# EasyEDA schematic SCH_SlimeVR Charge HUB_2022-04-14.json
TITLE: SlimeVR Charge Hub; REV: 1.0; Date: 2022-01-13; Sheet: 1/1; Drawn By: sevenxiaoyu1992; Company: Your Company
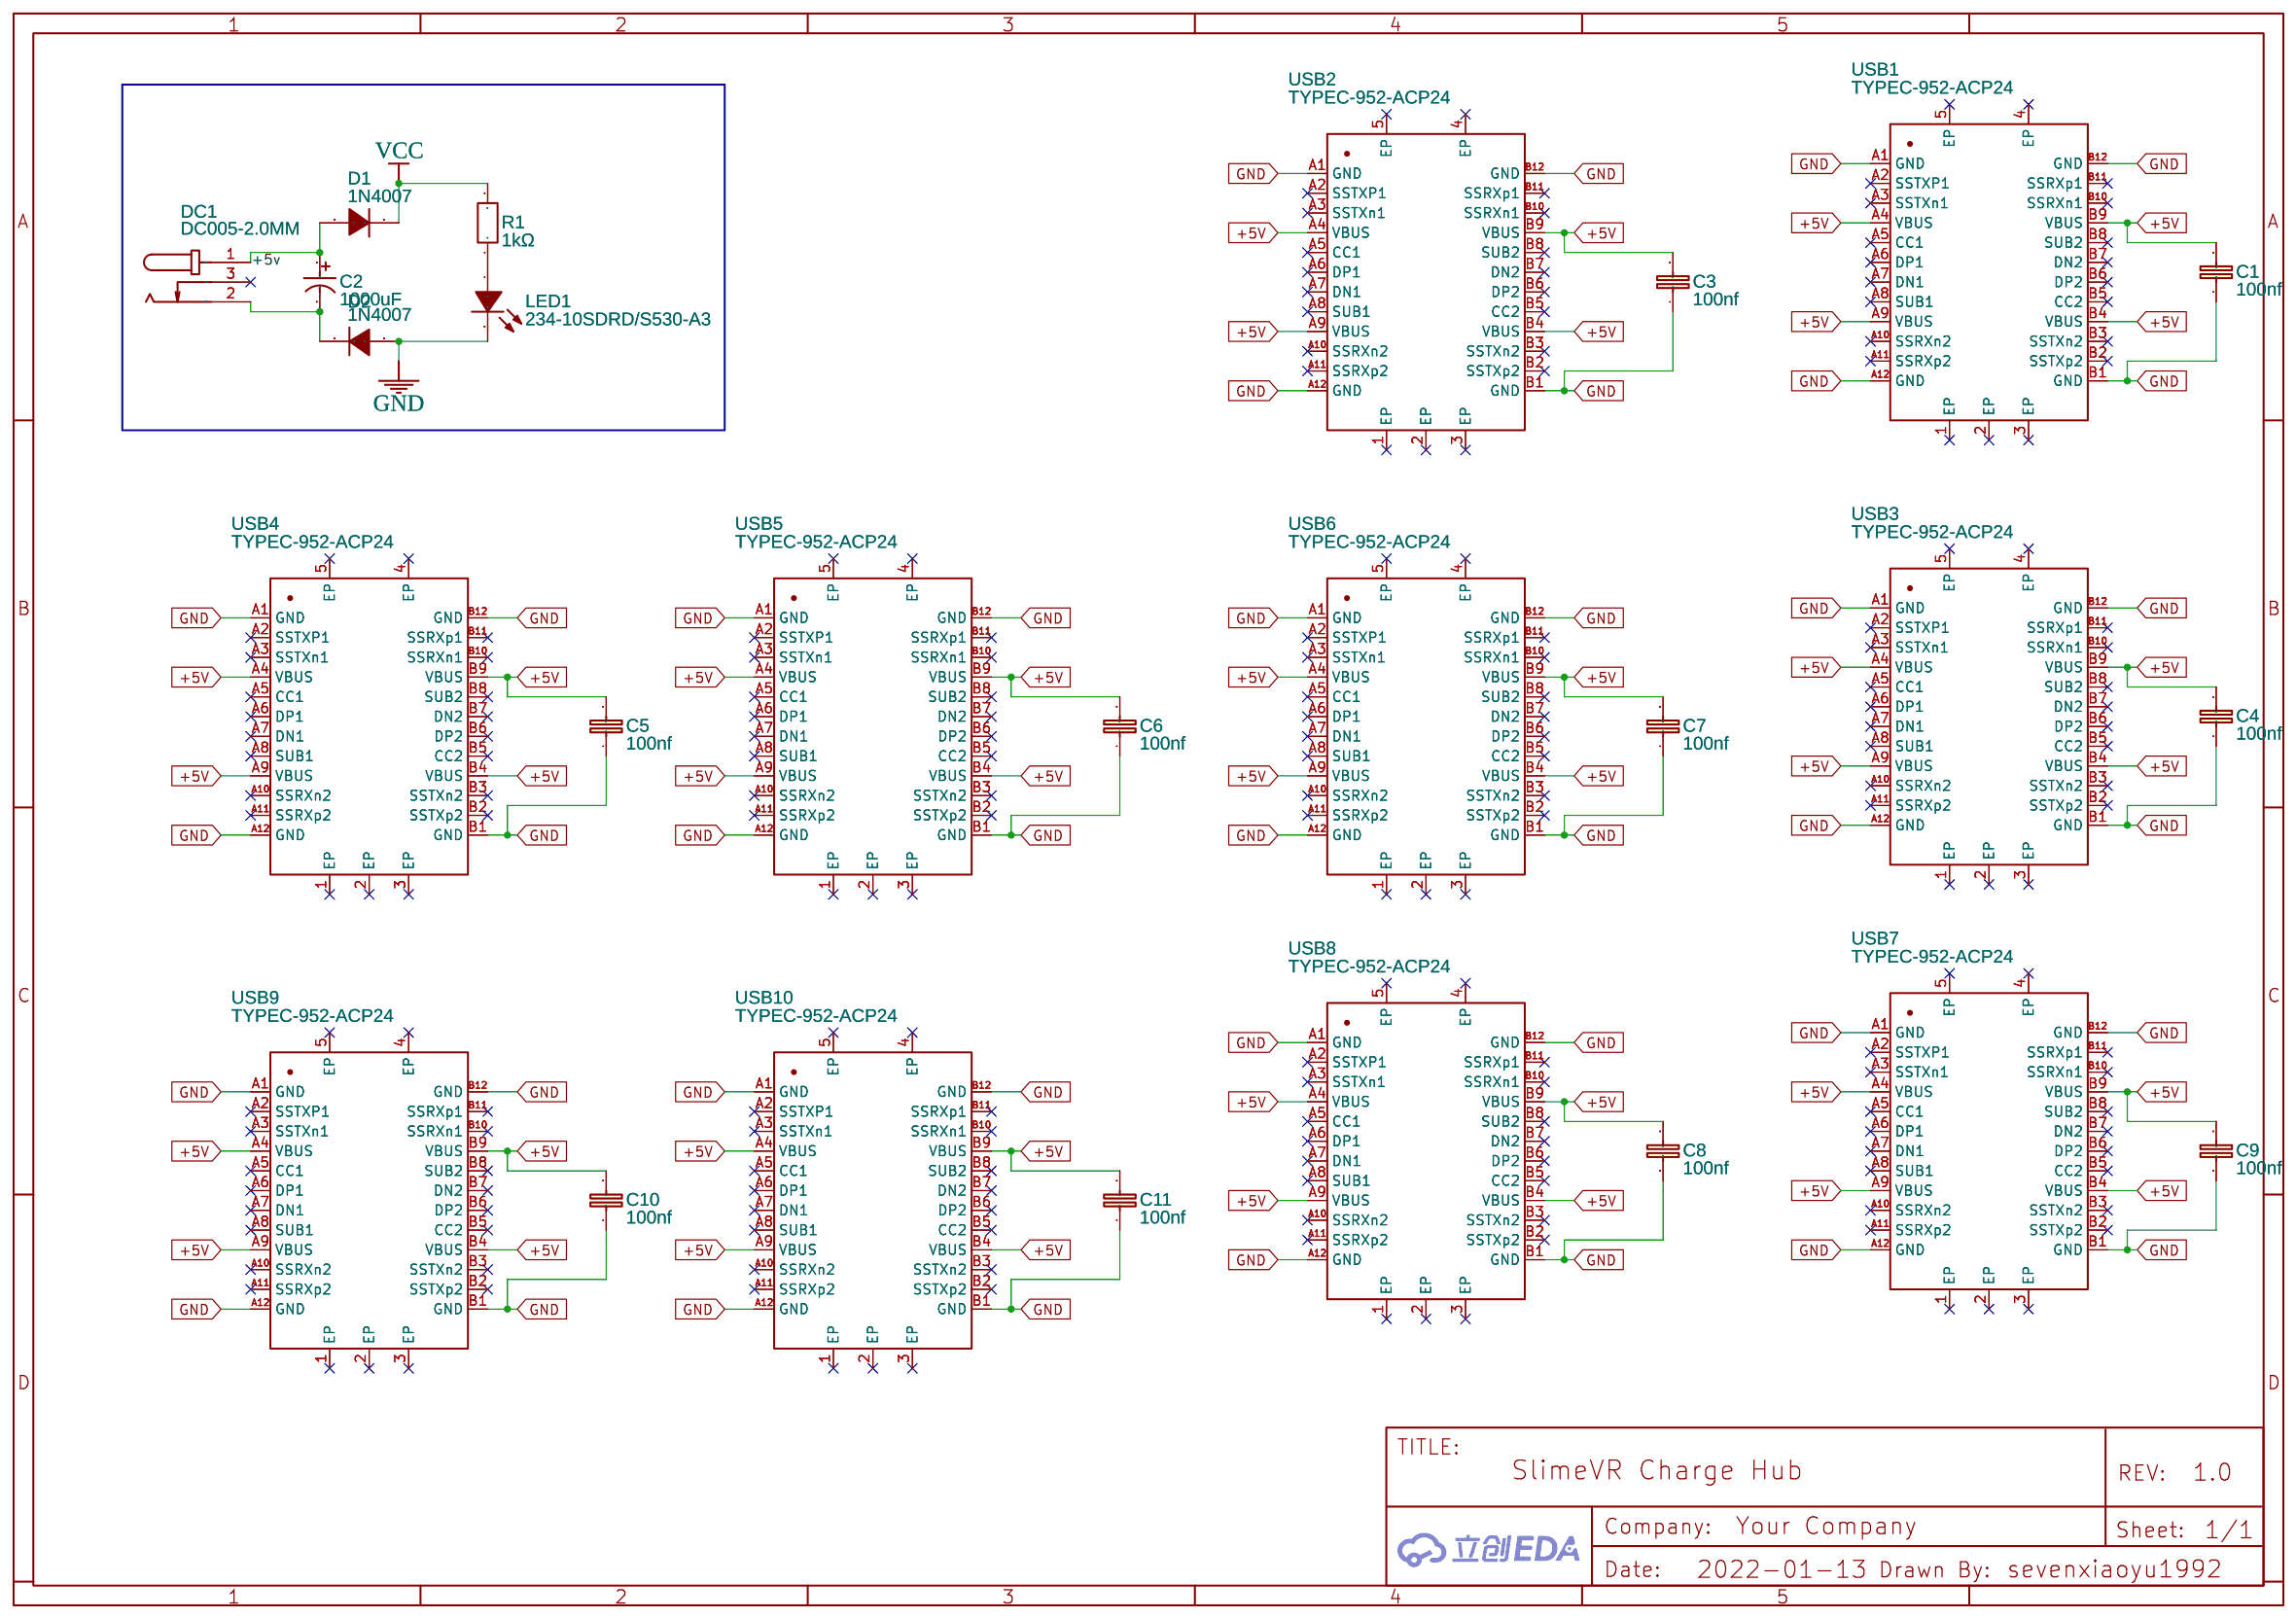
[diagram p0: schematic sheet]

## Parts
C1  100nf  [0603-CAP]
C2  1000uF  [CAP-TH_BD10.0-P5.00-D1.0-FD]
C3  100nf  [0603-CAP]
C4  100nf  [0603-CAP]
C5  100nf  [0603-CAP]
C6  100nf  [0603-CAP]
C7  100nf  [0603-CAP]
C8  100nf  [0603-CAP]
C9  100nf  [0603-CAP]
C10  100nf  [0603-CAP]
C11  100nf  [0603-CAP]
D1  1N4007  [DO-41_BD2.4-L4.7-P8.70-D0.9-RD]
D2  1N4007  [DO-41_BD2.4-L4.7-P8.70-D0.9-RD]
DC1  DC005-2.0MM  [DC-IN-TH_DC005]
LED1  234-10SDRD/S530-A3  [LED-TH_BD3.0-P2.54-FD]
R1  1kΩ  [RES-TH_BD3.2-L9.0-P13.00-D0.5]
USB1  TYPEC-952-ACP24  [USB-C-SMD_TYPEC-952-ACP24]
USB2  TYPEC-952-ACP24  [USB-C-SMD_TYPEC-952-ACP24]
USB3  TYPEC-952-ACP24  [USB-C-SMD_TYPEC-952-ACP24]
USB4  TYPEC-952-ACP24  [USB-C-SMD_TYPEC-952-ACP24]
USB5  TYPEC-952-ACP24  [USB-C-SMD_TYPEC-952-ACP24]
USB6  TYPEC-952-ACP24  [USB-C-SMD_TYPEC-952-ACP24]
USB7  TYPEC-952-ACP24  [USB-C-SMD_TYPEC-952-ACP24]
USB8  TYPEC-952-ACP24  [USB-C-SMD_TYPEC-952-ACP24]
USB9  TYPEC-952-ACP24  [USB-C-SMD_TYPEC-952-ACP24]
USB10  TYPEC-952-ACP24  [USB-C-SMD_TYPEC-952-ACP24]

## Library data of the parts
C1 C3-C11 = -: Capacitor; Contributor: SparkFun; Manufacturer Part: ?
C2 = 1000uF 10V 10*15: Supplier: LCSC; Manufacturer: ValuePro; Manufacturer Part: 1000uF 10V绿金 10*15; Supplier Part: C43339
D1 D2 = 1N4007: Supplier: LCSC; Manufacturer: SEMTECH; Supplier Part: C106903
DC1 = DC005-2.0MM: Supplier: LCSC; Manufacturer: SOFNG; Supplier Part: C111567
LED1 = 234-10SDRD/S530-A3: Supplier: LCSC; Supplier Part: C181866; Manufacturer: Everlight Elec; Contributor: LCSC; JLCPCB Part Class: Extended Part
R1 = MF1/2W-1KΩ±1%T52: Supplier: LCSC; Supplier Part: C714068; Manufacturer: Huaxing Mechanical-Elec.; Contributor: LCSC; JLCPCB Part Class: Extended Part
USB1-USB10 = TYPEC-952-ACP24: Supplier: LCSC; Supplier Part: C2840398; Manufacturer: XUNPU(讯普); Contributor: LCSC; JLCPCB Part Class: Extended Part

## Nets
+5V: C1.2 C3.2 C4.2 C5.2 C6.2 C7.2 C8.2 C9.2 C10.2 C11.2 USB1.A4(VBUS) USB1.A9(VBUS) USB1.B4(VBUS) USB1.B9(VBUS) USB2.A4(VBUS) USB2.A9(VBUS) USB2.B4(VBUS) USB2.B9(VBUS) USB3.A4(VBUS) USB3.A9(VBUS) USB3.B4(VBUS) USB3.B9(VBUS) USB4.A4(VBUS) USB4.A9(VBUS) USB4.B4(VBUS) USB4.B9(VBUS) USB5.A4(VBUS) USB5.A9(VBUS) USB5.B4(VBUS) USB5.B9(VBUS) USB6.A4(VBUS) USB6.A9(VBUS) USB6.B4(VBUS) USB6.B9(VBUS) USB7.A4(VBUS) USB7.A9(VBUS) USB7.B4(VBUS) USB7.B9(VBUS) USB8.A4(VBUS) USB8.A9(VBUS) USB8.B4(VBUS) USB8.B9(VBUS) USB9.A4(VBUS) USB9.A9(VBUS) USB9.B4(VBUS) USB9.B9(VBUS) USB10.A4(VBUS) USB10.A9(VBUS) USB10.B4(VBUS) USB10.B9(VBUS)
+5v: C2.1 D1.2(A) DC1.1
GND: C1.1 C3.1 C4.1 C5.1 C6.1 C7.1 C8.1 C9.1 C10.1 C11.1 D2.2(A) LED1.2(K) USB1.A1(GND) USB1.A12(GND) USB1.B1(GND) USB1.B12(GND) USB2.A1(GND) USB2.A12(GND) USB2.B1(GND) USB2.B12(GND) USB3.A1(GND) USB3.A12(GND) USB3.B1(GND) USB3.B12(GND) USB4.A1(GND) USB4.A12(GND) USB4.B1(GND) USB4.B12(GND) USB5.A1(GND) USB5.A12(GND) USB5.B1(GND) USB5.B12(GND) USB6.A1(GND) USB6.A12(GND) USB6.B1(GND) USB6.B12(GND) USB7.A1(GND) USB7.A12(GND) USB7.B1(GND) USB7.B12(GND) USB8.A1(GND) USB8.A12(GND) USB8.B1(GND) USB8.B12(GND) USB9.A1(GND) USB9.A12(GND) USB9.B1(GND) USB9.B12(GND) USB10.A1(GND) USB10.A12(GND) USB10.B1(GND) USB10.B12(GND)
VCC: D1.1(K) R1.2
Net-(C2-2): C2.2 D2.1(K) DC1.2
Net-(LED1-1): LED1.1(A) R1.1

Not connected (* = marked no-connect by the designer): DC1 3*; USB1 1(EP)* 2(EP)* 3(EP)* 4(EP)* 5(EP)* A2(SSTXP1)* A3(SSTXn1)* A5(CC1)* A6(DP1)* A7(DN1)* A8(SUB1)* A10(SSRXn2)* A11(SSRXp2)* B2(SSTXp2)* B3(SSTXn2)* B5(CC2)* B6(DP2)* B7(DN2)* B8(SUB2)* B10(SSRXn1)* B11(SSRXp1)*; USB2 1(EP)* 2(EP)* 3(EP)* 4(EP)* 5(EP)* A2(SSTXP1)* A3(SSTXn1)* A5(CC1)* A6(DP1)* A7(DN1)* A8(SUB1)* A10(SSRXn2)* A11(SSRXp2)* B2(SSTXp2)* B3(SSTXn2)* B5(CC2)* B6(DP2)* B7(DN2)* B8(SUB2)* B10(SSRXn1)* B11(SSRXp1)*; USB3 1(EP)* 2(EP)* 3(EP)* 4(EP)* 5(EP)* A2(SSTXP1)* A3(SSTXn1)* A5(CC1)* A6(DP1)* A7(DN1)* A8(SUB1)* A10(SSRXn2)* A11(SSRXp2)* B2(SSTXp2)* B3(SSTXn2)* B5(CC2)* B6(DP2)* B7(DN2)* B8(SUB2)* B10(SSRXn1)* B11(SSRXp1)*; USB4 1(EP)* 2(EP)* 3(EP)* 4(EP)* 5(EP)* A2(SSTXP1)* A3(SSTXn1)* A5(CC1)* A6(DP1)* A7(DN1)* A8(SUB1)* A10(SSRXn2)* A11(SSRXp2)* B2(SSTXp2)* B3(SSTXn2)* B5(CC2)* B6(DP2)* B7(DN2)* B8(SUB2)* B10(SSRXn1)* B11(SSRXp1)*; USB5 1(EP)* 2(EP)* 3(EP)* 4(EP)* 5(EP)* A2(SSTXP1)* A3(SSTXn1)* A5(CC1)* A6(DP1)* A7(DN1)* A8(SUB1)* A10(SSRXn2)* A11(SSRXp2)* B2(SSTXp2)* B3(SSTXn2)* B5(CC2)* B6(DP2)* B7(DN2)* B8(SUB2)* B10(SSRXn1)* B11(SSRXp1)*; USB6 1(EP)* 2(EP)* 3(EP)* 4(EP)* 5(EP)* A2(SSTXP1)* A3(SSTXn1)* A5(CC1)* A6(DP1)* A7(DN1)* A8(SUB1)* A10(SSRXn2)* A11(SSRXp2)* B2(SSTXp2)* B3(SSTXn2)* B5(CC2)* B6(DP2)* B7(DN2)* B8(SUB2)* B10(SSRXn1)* B11(SSRXp1)*; USB7 1(EP)* 2(EP)* 3(EP)* 4(EP)* 5(EP)* A2(SSTXP1)* A3(SSTXn1)* A5(CC1)* A6(DP1)* A7(DN1)* A8(SUB1)* A10(SSRXn2)* A11(SSRXp2)* B2(SSTXp2)* B3(SSTXn2)* B5(CC2)* B6(DP2)* B7(DN2)* B8(SUB2)* B10(SSRXn1)* B11(SSRXp1)*; USB8 1(EP)* 2(EP)* 3(EP)* 4(EP)* 5(EP)* A2(SSTXP1)* A3(SSTXn1)* A5(CC1)* A6(DP1)* A7(DN1)* A8(SUB1)* A10(SSRXn2)* A11(SSRXp2)* B2(SSTXp2)* B3(SSTXn2)* B5(CC2)* B6(DP2)* B7(DN2)* B8(SUB2)* B10(SSRXn1)* B11(SSRXp1)*; USB9 1(EP)* 2(EP)* 3(EP)* 4(EP)* 5(EP)* A2(SSTXP1)* A3(SSTXn1)* A5(CC1)* A6(DP1)* A7(DN1)* A8(SUB1)* A10(SSRXn2)* A11(SSRXp2)* B2(SSTXp2)* B3(SSTXn2)* B5(CC2)* B6(DP2)* B7(DN2)* B8(SUB2)* B10(SSRXn1)* B11(SSRXp1)*; USB10 1(EP)* 2(EP)* 3(EP)* 4(EP)* 5(EP)* A2(SSTXP1)* A3(SSTXn1)* A5(CC1)* A6(DP1)* A7(DN1)* A8(SUB1)* A10(SSRXn2)* A11(SSRXp2)* B2(SSTXp2)* B3(SSTXn2)* B5(CC2)* B6(DP2)* B7(DN2)* B8(SUB2)* B10(SSRXn1)* B11(SSRXp1)*
